# Altium schematic sheet IO.SchDoc
size A4
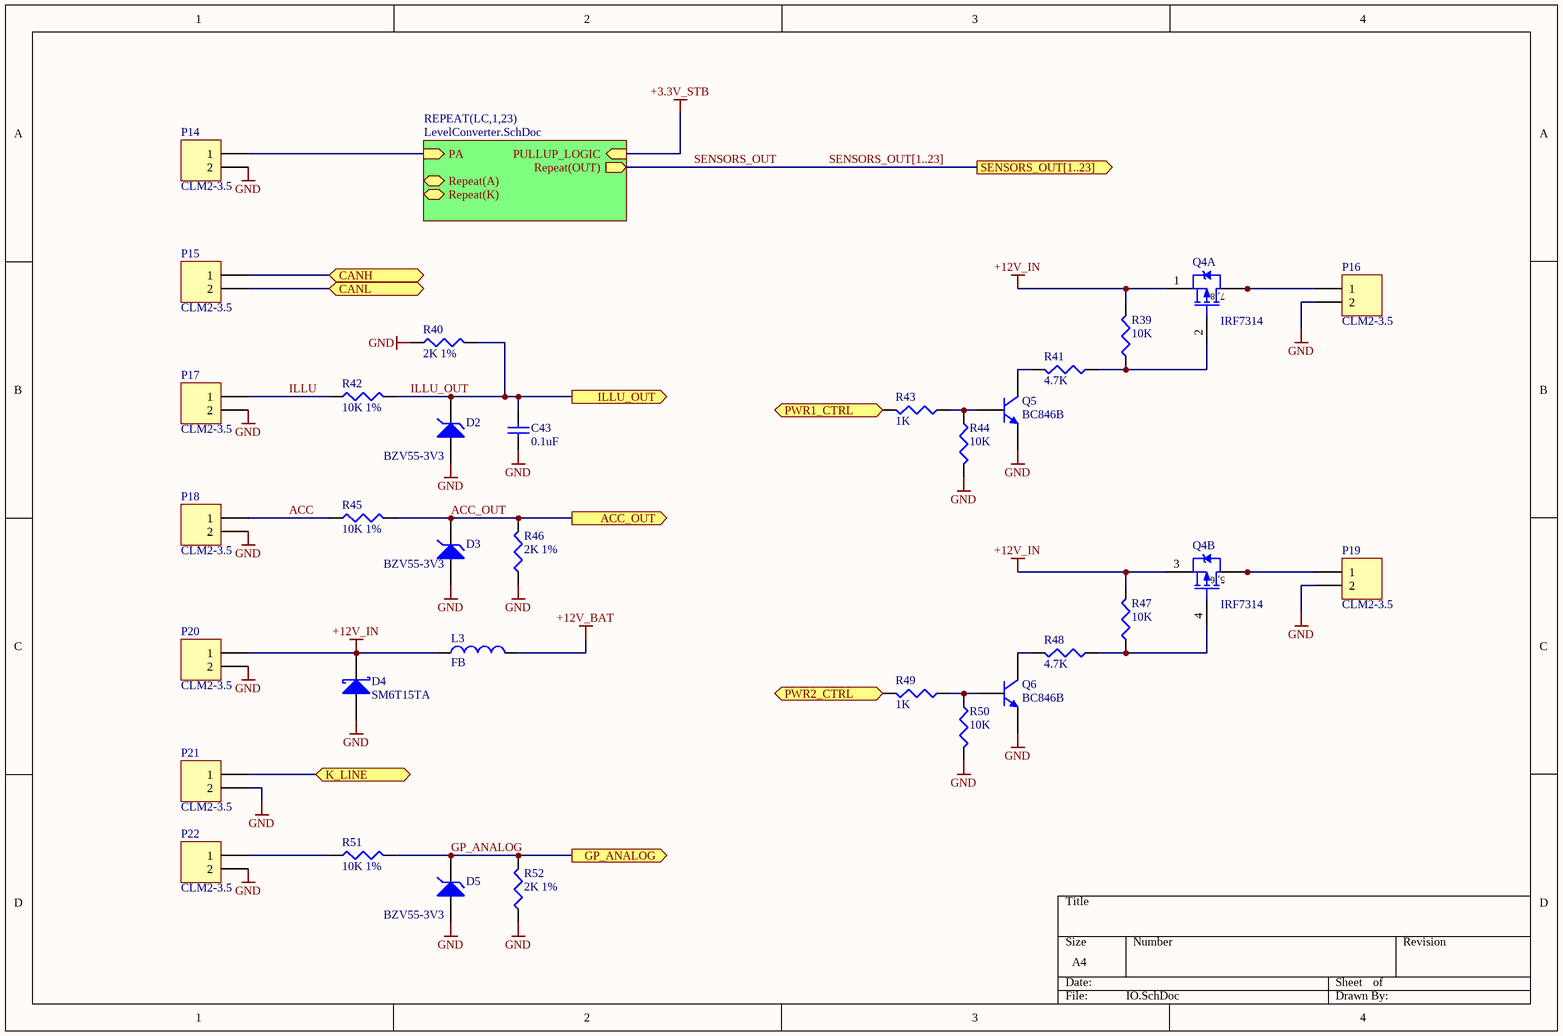
[diagram p0: IO.SchDoc]

## Parts
C43  0.1uF  [2012[0805]]
D2  BZV55-3V3  [SOD-80/MLL34]
D3  BZV55-3V3  [SOD-80/MLL34]
D4  SM6T15TA  [SMB]
D5  BZV55-3V3  [SOD-80/MLL34]
L3  FB  [INDC4516AN]
P14  CLM2-3.5  [CLM2-3.5]
P15  CLM2-3.5  [CLM2-3.5]
P16  CLM2-3.5  [CLM2-3.5]
P17  CLM2-3.5  [CLM2-3.5]
P18  CLM2-3.5  [CLM2-3.5]
P19  CLM2-3.5  [CLM2-3.5]
P20  CLM2-3.5  [CLM2-3.5]
P21  CLM2-3.5  [CLM2-3.5]
P22  CLM2-3.5  [CLM2-3.5]
Q4  IRF7314  [SO-8_N]  (parts A,B of 2)
Q5  BC846B  [SOT23_N]
Q6  BC846B  [SOT23_N]
R39  10K  [R2012[0805]]
R40  2K 1%  [R2012[0805]]
R41  4.7K  [R2012[0805]]
R42  10K 1%  [R2012[0805]]
R43  1K  [R2012[0805]]
R44  10K  [R2012[0805]]
R45  10K 1%  [R2012[0805]]
R46  2K 1%  [R2012[0805]]
R47  10K  [R2012[0805]]
R48  4.7K  [R2012[0805]]
R49  1K  [R2012[0805]]
R50  10K  [R2012[0805]]
R51  10K 1%  [R2012[0805]]
R52  2K 1%  [R2012[0805]]

## Sub-sheets
REPEAT(LC,1,23) = LevelConverter.SchDoc: Repeat(K) (bidir), Repeat(OUT) (out), Repeat(A) (bidir), PULLUP_LOGIC (in), PA (in)

## Ports
ACC_OUT (out), CANH (bidir), CANL (bidir), GP_ANALOG (out), ILLU_OUT (out), K_LINE (bidir), PWR1_CTRL (in), PWR2_CTRL (in), SENSORS_OUT[1..23] (out)

## Nets
+3.3V_STB: sheet REPEAT(LC,1,23)/PULLUP_LOGIC
+12V_BAT: L3.2
+12V_IN: D4.2(K) L3.1 P20.1 Q4.1(S) Q4.3(S) R39.2 R47.2
GND: C43.1 D2.1(A) D3.1(A) D4.1(A) D5.1(A) P14.2 P16.2 P17.2 P18.2 P19.2 P20.2 P21.2 P22.2 Q5.2(E) Q6.2(E) R40.2 R44.2 R46.2 R50.2 R52.2
ACC: P18.1 R45.2
ACC_OUT: D3.2(K) R45.1 R46.1 ; port ACC_OUT
CANH: P15.1 ; port CANH
CANL: P15.2 ; port CANL
GP_ANALOG: D5.2(K) R51.1 R52.1 ; port GP_ANALOG
ILLU: P17.1 R42.2
ILLU_OUT: C43.2 D2.2(K) R40.1 R42.1 ; port ILLU_OUT
K_LINE: P21.1 ; port K_LINE
PWR1_CTRL: R43.2 ; port PWR1_CTRL
PWR2_CTRL: R49.2 ; port PWR2_CTRL
SENSORS_OUT: sheet REPEAT(LC,1,23)/Repeat(OUT)
NetP14_1: P14.1 ; sheet REPEAT(LC,1,23)/PA
NetP16_1: P16.1 Q4.7(D) Q4.8(D)
NetP19_1: P19.1 Q4.5(D) Q4.6(D)
NetP22_1: P22.1 R51.2
NetQ4_2: Q4.2(G) R39.1 R41.1
NetQ4_4: Q4.4(G) R47.1 R48.1
NetQ5_1: Q5.1(B) R43.1 R44.1
NetQ5_3: Q5.3(C) R41.2
NetQ6_1: Q6.1(B) R49.1 R50.1
NetQ6_3: Q6.3(C) R48.2

## Buses and harness runs
bus SENSORS_OUT[1..23] = port SENSORS_OUT[1..23]

## Notes on the sheet
- (in symbol IRF7314, part A) 7, 8
- (in symbol IRF7314, part B) 5, 6

## Library data of the parts
C43 = C0805: Ceramic Chip Capacitor - Standard; Note: Footprint corresponds to dimensions for bulk cassette packaging. This case size has tightened tolerances.; Published: 17-Jul-2002; LatestRevisionDate: 19-Mar-2004; LatestRevisionNote: Silkscreen size reduced.; DatasheetDocument: Mar-2001; PackageDocument: Mar-2001; PackageReference: 0805; Publisher: Altium Limited; Code_JEITA: 0805; Code_IPC: 2012[0805]; ComponentLink1Description: Manufacturer Link; ComponentLink1URL: http://www.kemet.com/; ComponentLink2Description: Datasheet; ComponentLink2URL: http://www.kemet.com/kemet/web/homepage/kechome.nsf/vapubfilesname/F3102TA.pdf/$file/F3102TA.pdf; Value: 0.1uF
D2 D3 D5 = D Zener: Zener Diode; Published: 8-Jun-2000; LatestRevisionDate: 17-Jul-2002; LatestRevisionNote: Re-released for DXP Platform.; PackageReference: DIODE-0.7; Publisher: Altium Limited; PackageDescription: Diode, Thru-Hole; 2 Leads; 0.7 in Pin Spacing
D4 = D Schottky: Published: 8-Jun-2000; LatestRevisionDate: 17-Jul-2002; LatestRevisionNote: Re-released for DXP Platform.; PackageReference: SMB; Publisher: Altium Limited; PackageDescription: DO-214-AA/SMB; 2 C-Bend Leads; Body 5.3 x 3.6 mm, inc. leads (LxW); Code_JEDEC: DO-214-AA
L3 = Inductor: BLM41PG600SN1L; Code_IEC: 1005; Value: 10mH; Published: 8-Jun-2000; LatestRevisionDate: 29-May-2009; LatestRevisionNote: IPC-7351 Footprint Added.; PackageReference: 0402-A; Publisher: Altium Limited; PackageDescription: Chip Inductor; Code_JEITA: 0402
Q4 = IRF7314: HEXFET Power MOSFET; Published: 8-Jun-2000; LatestRevisionDate: 13-Apr-2006; LatestRevisionNote: IPC-7351 Footprint Added.; DatasheetVersion: Nov-1997; PackageVersion: Feb-2001; PackageReference: SO-8; Publisher: Altium Limited; PackageDescription: 8-Pin Plastic Small Outline Integrated Circuit 1.27 mm Pitch; Code_JEDEC: MS-012-AA; Code_IPC: SOIC127P600-8; ComponentLink1Description: Manufacturer Link; ComponentLink1URL: http://www.irf.com/; ComponentLink2Description: Datasheet; ComponentLink2URL: http://www.irf.com/product-info/datasheets/data/irf7314.pdf
Q5 Q6 = BC846B: NPN General-purpose Transistor; Published: 17-Sep-2003; LatestRevisionDate: 12-Dec-2006; LatestRevisionNote: IPC-7351 Footprint Added.; DatasheetVersion: 4-Feb-2002; PackageVersion: May-1999; PackageReference: SOT23; Publisher: Altium Limited; PackageDescription: 3-Pin SOT-23 Package 0.95 mm Pitch, 2.3 mm Lead Span; ComponentLink1Description: Manufacturer Link; ComponentLink1URL: http://www.semiconductors.philips.com/; ComponentLink2Description: Datasheet; ComponentLink2URL: http://www.semiconductors.philips.com/acrobat/datasheets/BC846_BC847_BC848_5.pdf
R39-R52 = R0805: Published: 8-Jun-2000; LatestRevisionDate: 29-May-2009; LatestRevisionNote: IPC-7351 Footprint Added.; PackageReference: J1-0603; Publisher: Altium Limited; PackageDescription: Chip Resistor
  R39 R42 R44 R45 R47 R50 R51: Value: 10K
  R40 R46 R52: Value: 2K
  R41 R48: Value: 4.7K
  R43 R49: Value: 1K